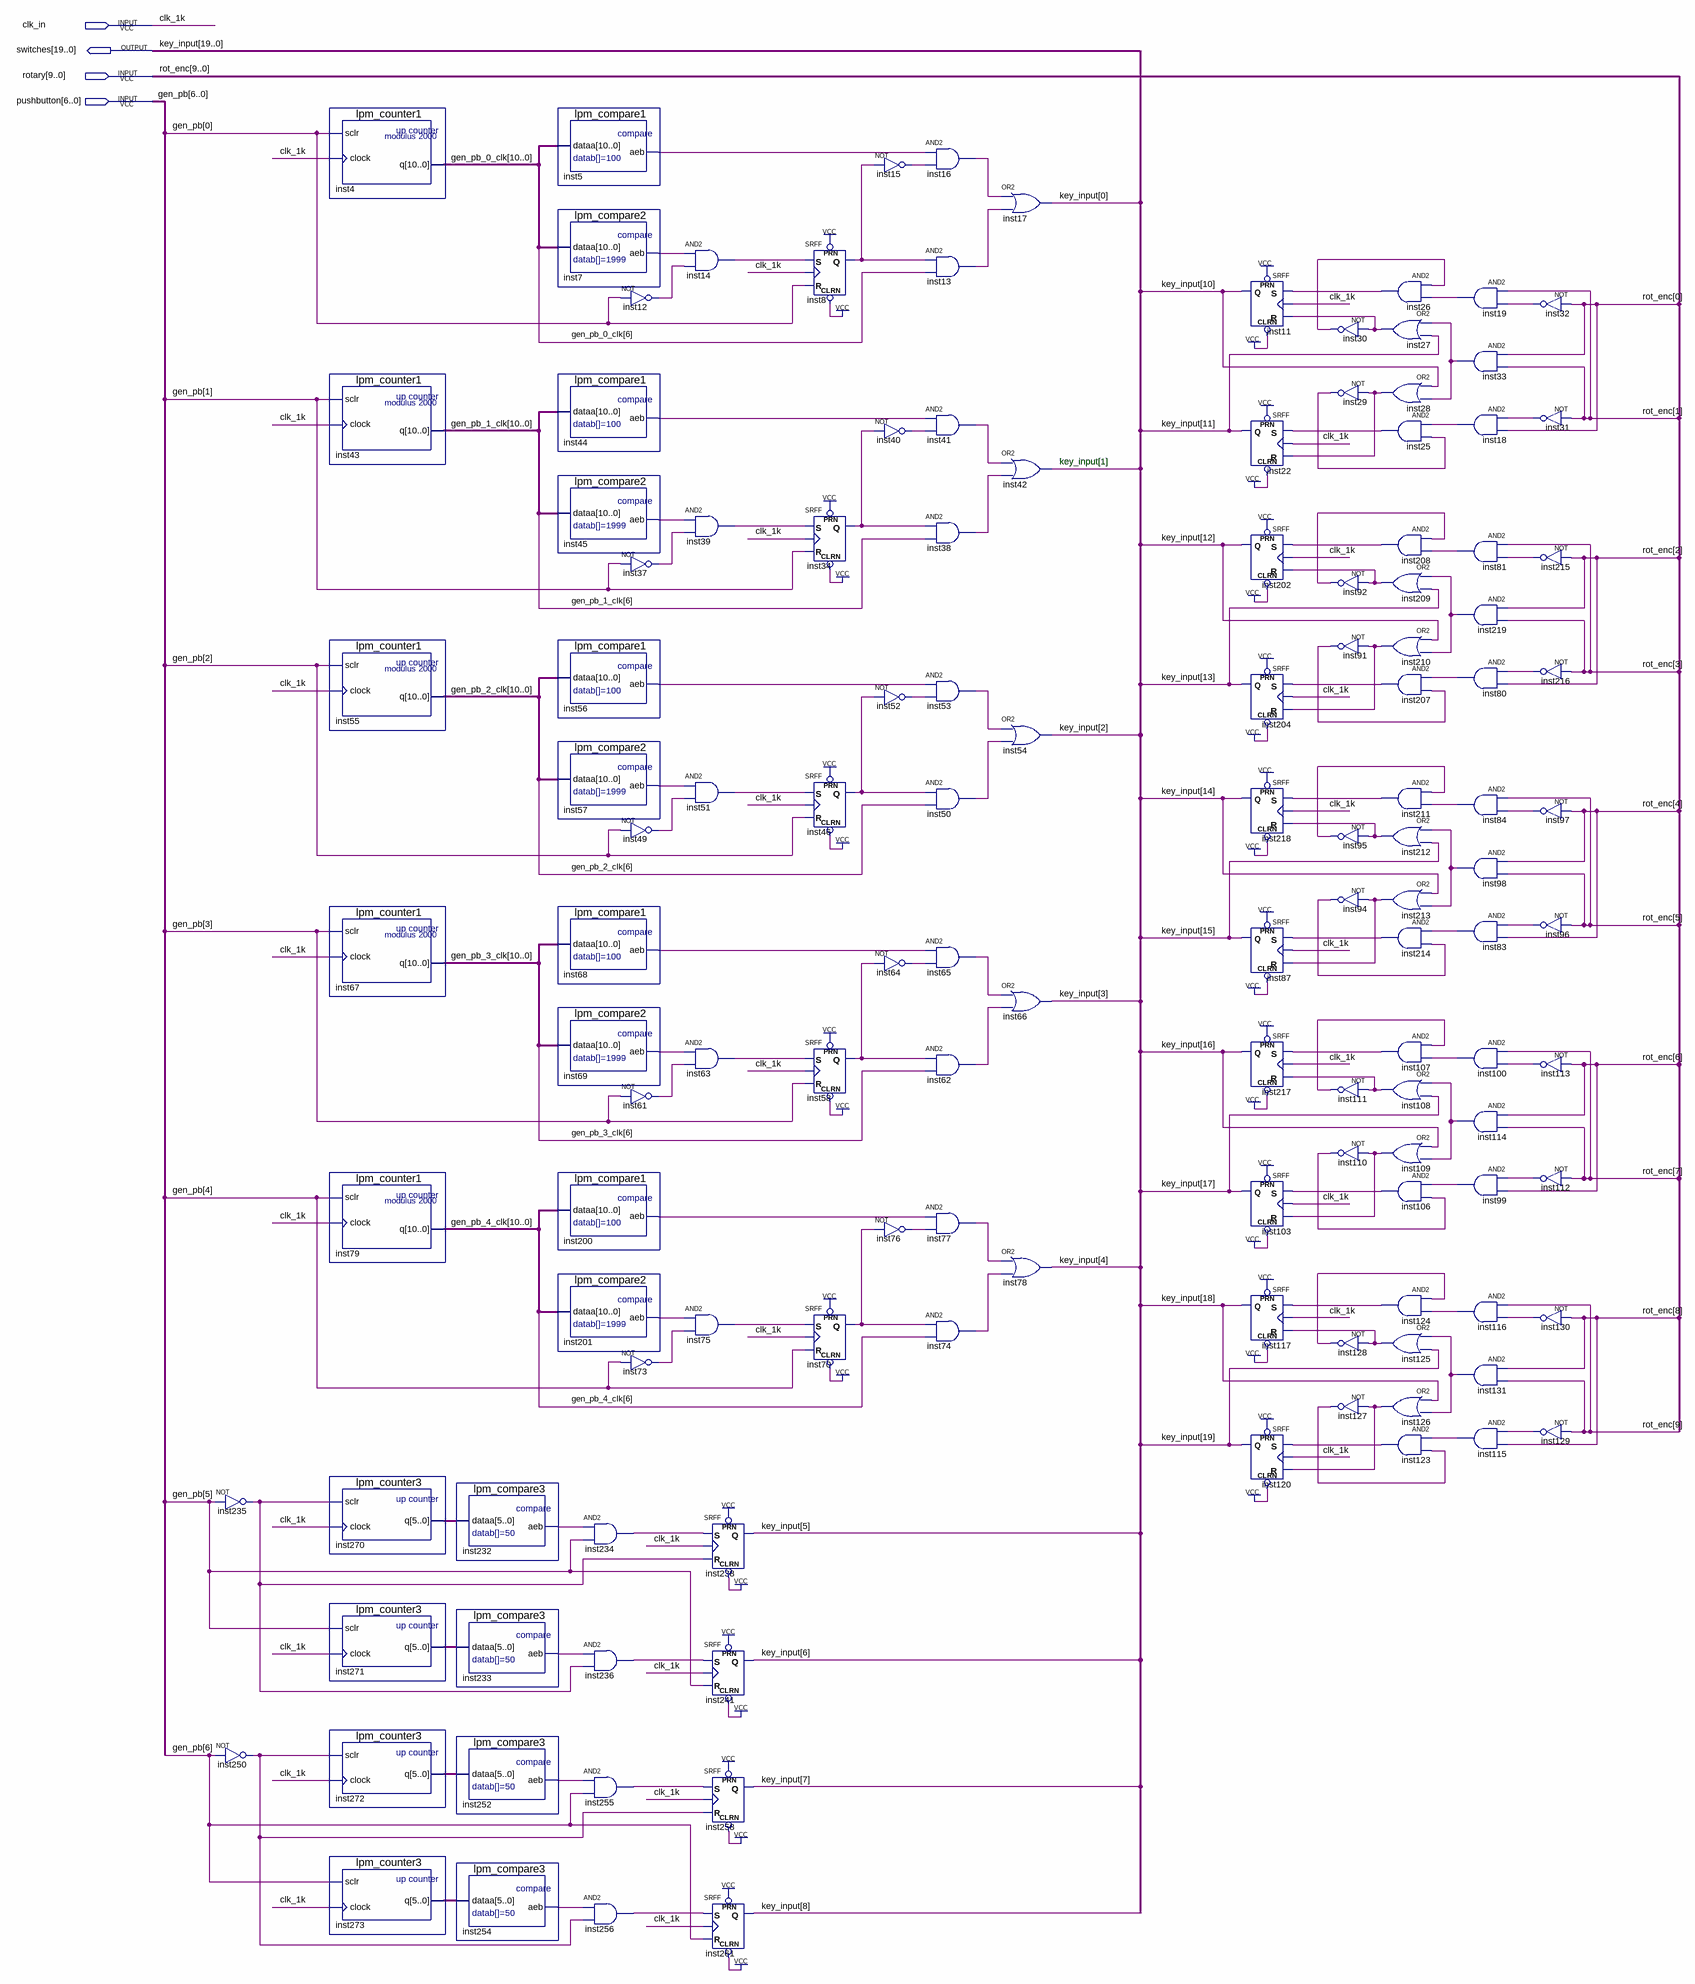
[diagram p0: schematic sheet]
// Quartus schematic keys.bdf as structural Verilog: 133 symbols, 4 pins
module keys (
  input  clk_in,
  input  [9:0] rotary,
  input  [6:0] pushbutton,
  output [19:0] switches
);

  wire inst5_aeb, inst7_aeb, inst8_q, inst12_out, inst13_out, inst14_out, inst15_out, inst16_out, inst18_out,
       inst19_out, inst25_out, inst26_out, inst27_out, inst28_out, inst29_out, inst30_out, inst31_out,
       inst32_out, inst33_out, inst34_q, inst37_out, inst38_out, inst39_out, inst40_out, inst41_out,
       inst44_aeb, inst45_aeb, inst46_q, inst49_out, inst50_out, inst51_out, inst52_out, inst53_out,
       inst56_aeb, inst57_aeb, inst58_q, inst61_out, inst62_out, inst63_out, inst64_out, inst65_out,
       inst68_aeb, inst69_aeb, inst70_q, inst73_out, inst74_out, inst75_out, inst76_out, inst77_out,
       inst80_out, inst81_out, inst83_out, inst84_out, inst91_out, inst92_out, inst94_out, inst95_out,
       inst96_out, inst97_out, inst98_out, inst99_out, inst100_out, inst106_out, inst107_out, inst108_out,
       inst109_out, inst110_out, inst111_out, inst112_out, inst113_out, inst114_out, inst115_out,
       inst116_out, inst123_out, inst124_out, inst125_out, inst126_out, inst127_out, inst128_out,
       inst129_out, inst130_out, inst131_out, inst200_aeb, inst201_aeb, inst207_out, inst208_out,
       inst209_out, inst210_out, inst211_out, inst212_out, inst213_out, inst214_out, inst215_out,
       inst216_out, inst219_out, inst232_aeb, inst233_aeb, inst234_out, inst235_out, inst236_out,
       inst250_out, inst252_aeb, inst254_aeb, inst255_out, inst256_out;
  wire [5:0] inst270_q, inst271_q, inst272_q, inst273_q;
  wire [10:0] gen_pb_0_clk, gen_pb_1_clk, gen_pb_2_clk, gen_pb_3_clk, gen_pb_4_clk;

  not inst235 (inst235_out, pushbutton[5]);
  not inst250 (inst250_out, pushbutton[6]);
  lpm_counter1 inst4 (.sclr(pushbutton[0]), .clock(clk_in), .q(gen_pb_0_clk));
  lpm_counter1 inst43 (.sclr(pushbutton[1]), .clock(clk_in), .q(gen_pb_1_clk));
  lpm_counter1 inst55 (.sclr(pushbutton[2]), .clock(clk_in), .q(gen_pb_2_clk));
  lpm_counter1 inst67 (.sclr(pushbutton[3]), .clock(clk_in), .q(gen_pb_3_clk));
  lpm_counter1 inst79 (.sclr(pushbutton[4]), .clock(clk_in), .q(gen_pb_4_clk));
  lpm_counter3 inst270 (.sclr(inst235_out), .clock(clk_in), .q(inst270_q));
  lpm_counter3 inst271 (.sclr(pushbutton[5]), .clock(clk_in), .q(inst271_q));
  lpm_counter3 inst272 (.sclr(inst250_out), .clock(clk_in), .q(inst272_q));
  lpm_counter3 inst273 (.sclr(pushbutton[6]), .clock(clk_in), .q(inst273_q));
  lpm_compare3 inst232 (.dataa(inst270_q), .aeb(inst232_aeb));
  lpm_compare3 inst233 (.dataa(inst271_q), .aeb(inst233_aeb));
  lpm_compare3 inst252 (.dataa(inst272_q), .aeb(inst252_aeb));
  lpm_compare3 inst254 (.dataa(inst273_q), .aeb(inst254_aeb));
  lpm_compare1 inst5 (.dataa(gen_pb_0_clk), .aeb(inst5_aeb));
  lpm_compare2 inst7 (.dataa(gen_pb_0_clk), .aeb(inst7_aeb));
  lpm_compare1 inst44 (.dataa(gen_pb_1_clk), .aeb(inst44_aeb));
  lpm_compare2 inst45 (.dataa(gen_pb_1_clk), .aeb(inst45_aeb));
  lpm_compare1 inst56 (.dataa(gen_pb_2_clk), .aeb(inst56_aeb));
  lpm_compare2 inst57 (.dataa(gen_pb_2_clk), .aeb(inst57_aeb));
  lpm_compare1 inst68 (.dataa(gen_pb_3_clk), .aeb(inst68_aeb));
  lpm_compare2 inst69 (.dataa(gen_pb_3_clk), .aeb(inst69_aeb));
  lpm_compare1 inst200 (.dataa(gen_pb_4_clk), .aeb(inst200_aeb));
  lpm_compare2 inst201 (.dataa(gen_pb_4_clk), .aeb(inst201_aeb));
  and inst234 (inst234_out, inst232_aeb, pushbutton[5]);
  and inst236 (inst236_out, inst233_aeb, inst235_out);
  and inst255 (inst255_out, inst252_aeb, pushbutton[6]);
  and inst256 (inst256_out, inst254_aeb, inst250_out);
  not inst12 (inst12_out, pushbutton[0]);
  not inst37 (inst37_out, pushbutton[1]);
  not inst49 (inst49_out, pushbutton[2]);
  not inst61 (inst61_out, pushbutton[3]);
  not inst73 (inst73_out, pushbutton[4]);
  and inst14 (inst14_out, inst7_aeb, inst12_out);
  and inst39 (inst39_out, inst45_aeb, inst37_out);
  and inst51 (inst51_out, inst57_aeb, inst49_out);
  and inst63 (inst63_out, inst69_aeb, inst61_out);
  and inst75 (inst75_out, inst201_aeb, inst73_out);
  SRFF inst238 (.PRN(1'b1), .CLRN(1'b1), .S(inst234_out), .R(inst235_out), .CLK(clk_in), .Q(switches[5]));
  SRFF inst241 (.PRN(1'b1), .CLRN(1'b1), .S(inst236_out), .R(pushbutton[5]), .CLK(clk_in), .Q(switches[6]));
  SRFF inst258 (.PRN(1'b1), .CLRN(1'b1), .S(inst255_out), .R(inst250_out), .CLK(clk_in), .Q(switches[7]));
  SRFF inst261 (.PRN(1'b1), .CLRN(1'b1), .S(inst256_out), .R(pushbutton[6]), .CLK(clk_in), .Q(switches[8]));
  SRFF inst8 (.PRN(1'b1), .CLRN(1'b1), .S(inst14_out), .R(pushbutton[0]), .CLK(clk_in), .Q(inst8_q));
  SRFF inst34 (.PRN(1'b1), .CLRN(1'b1), .S(inst39_out), .R(pushbutton[1]), .CLK(clk_in), .Q(inst34_q));
  SRFF inst46 (.PRN(1'b1), .CLRN(1'b1), .S(inst51_out), .R(pushbutton[2]), .CLK(clk_in), .Q(inst46_q));
  SRFF inst58 (.PRN(1'b1), .CLRN(1'b1), .S(inst63_out), .R(pushbutton[3]), .CLK(clk_in), .Q(inst58_q));
  SRFF inst70 (.PRN(1'b1), .CLRN(1'b1), .S(inst75_out), .R(pushbutton[4]), .CLK(clk_in), .Q(inst70_q));
  not inst15 (inst15_out, inst8_q);
  not inst40 (inst40_out, inst34_q);
  not inst52 (inst52_out, inst46_q);
  not inst64 (inst64_out, inst58_q);
  not inst76 (inst76_out, inst70_q);
  and inst16 (inst16_out, inst5_aeb, inst15_out);
  and inst13 (inst13_out, inst8_q, gen_pb_0_clk[6]);
  and inst41 (inst41_out, inst44_aeb, inst40_out);
  and inst38 (inst38_out, inst34_q, gen_pb_1_clk[6]);
  and inst53 (inst53_out, inst56_aeb, inst52_out);
  and inst50 (inst50_out, inst46_q, gen_pb_2_clk[6]);
  and inst65 (inst65_out, inst68_aeb, inst64_out);
  and inst62 (inst62_out, inst58_q, gen_pb_3_clk[6]);
  and inst77 (inst77_out, inst200_aeb, inst76_out);
  and inst74 (inst74_out, inst70_q, gen_pb_4_clk[6]);
  or inst17 (switches[0], inst16_out, inst13_out);
  or inst42 (switches[1], inst41_out, inst38_out);
  or inst54 (switches[2], inst53_out, inst50_out);
  or inst66 (switches[3], inst65_out, inst62_out);
  or inst78 (switches[4], inst77_out, inst74_out);
  SRFF inst11 (.PRN(1'b1), .CLRN(1'b1), .S(inst26_out), .R(inst27_out), .CLK(clk_in), .Q(switches[10]));
  SRFF inst22 (.PRN(1'b1), .CLRN(1'b1), .S(inst25_out), .R(inst28_out), .CLK(clk_in), .Q(switches[11]));
  SRFF inst202 (.PRN(1'b1), .CLRN(1'b1), .S(inst208_out), .R(inst209_out), .CLK(clk_in), .Q(switches[12]));
  SRFF inst204 (.PRN(1'b1), .CLRN(1'b1), .S(inst207_out), .R(inst210_out), .CLK(clk_in), .Q(switches[13]));
  SRFF inst218 (.PRN(1'b1), .CLRN(1'b1), .S(inst211_out), .R(inst212_out), .CLK(clk_in), .Q(switches[14]));
  SRFF inst87 (.PRN(1'b1), .CLRN(1'b1), .S(inst214_out), .R(inst213_out), .CLK(clk_in), .Q(switches[15]));
  SRFF inst217 (.PRN(1'b1), .CLRN(1'b1), .S(inst107_out), .R(inst108_out), .CLK(clk_in), .Q(switches[16]));
  SRFF inst103 (.PRN(1'b1), .CLRN(1'b1), .S(inst106_out), .R(inst109_out), .CLK(clk_in), .Q(switches[17]));
  SRFF inst117 (.PRN(1'b1), .CLRN(1'b1), .S(inst124_out), .R(inst125_out), .CLK(clk_in), .Q(switches[18]));
  SRFF inst120 (.PRN(1'b1), .CLRN(1'b1), .S(inst123_out), .R(inst126_out), .CLK(clk_in), .Q(switches[19]));
  not inst30 (inst30_out, inst27_out);
  not inst29 (inst29_out, inst28_out);
  not inst92 (inst92_out, inst209_out);
  not inst91 (inst91_out, inst210_out);
  not inst95 (inst95_out, inst212_out);
  not inst94 (inst94_out, inst213_out);
  not inst111 (inst111_out, inst108_out);
  not inst110 (inst110_out, inst109_out);
  not inst128 (inst128_out, inst125_out);
  not inst127 (inst127_out, inst126_out);
  and inst26 (inst26_out, inst30_out, inst19_out);
  or inst27 (inst27_out, inst33_out, switches[11]);
  or inst28 (inst28_out, switches[10], inst33_out);
  and inst25 (inst25_out, inst18_out, inst29_out);
  and inst208 (inst208_out, inst92_out, inst81_out);
  or inst209 (inst209_out, inst219_out, switches[13]);
  or inst210 (inst210_out, switches[12], inst219_out);
  and inst207 (inst207_out, inst80_out, inst91_out);
  and inst211 (inst211_out, inst95_out, inst84_out);
  or inst212 (inst212_out, inst98_out, switches[15]);
  or inst213 (inst213_out, switches[14], inst98_out);
  and inst214 (inst214_out, inst83_out, inst94_out);
  and inst107 (inst107_out, inst111_out, inst100_out);
  or inst108 (inst108_out, inst114_out, switches[17]);
  or inst109 (inst109_out, switches[16], inst114_out);
  and inst106 (inst106_out, inst99_out, inst110_out);
  and inst124 (inst124_out, inst128_out, inst116_out);
  or inst125 (inst125_out, inst131_out, switches[19]);
  or inst126 (inst126_out, switches[18], inst131_out);
  and inst123 (inst123_out, inst115_out, inst127_out);
  and inst19 (inst19_out, rotary[1], inst32_out);
  and inst33 (inst33_out, rotary[0], rotary[1]);
  and inst18 (inst18_out, inst31_out, rotary[0]);
  and inst81 (inst81_out, rotary[3], inst215_out);
  and inst219 (inst219_out, rotary[2], rotary[3]);
  and inst80 (inst80_out, inst216_out, rotary[2]);
  and inst84 (inst84_out, rotary[5], inst97_out);
  and inst98 (inst98_out, rotary[4], rotary[5]);
  and inst83 (inst83_out, inst96_out, rotary[4]);
  and inst100 (inst100_out, rotary[7], inst113_out);
  and inst114 (inst114_out, rotary[6], rotary[7]);
  and inst99 (inst99_out, inst112_out, rotary[6]);
  and inst116 (inst116_out, rotary[9], inst130_out);
  and inst131 (inst131_out, rotary[8], rotary[9]);
  and inst115 (inst115_out, inst129_out, rotary[8]);
  not inst32 (inst32_out, rotary[0]);
  not inst31 (inst31_out, rotary[1]);
  not inst215 (inst215_out, rotary[2]);
  not inst216 (inst216_out, rotary[3]);
  not inst97 (inst97_out, rotary[4]);
  not inst96 (inst96_out, rotary[5]);
  not inst113 (inst113_out, rotary[6]);
  not inst112 (inst112_out, rotary[7]);
  not inst130 (inst130_out, rotary[8]);
  not inst129 (inst129_out, rotary[9]);

  // Other names for the same wires on the sheet: clk_1k = clk_in; gen_pb[6:0] = pushbutton;
  //   key_input[19:0] = switches; rot_enc[9:0] = rotary

  // Notes on the sheet:
  //   key_input[1]
endmodule
